# Altium schematic sheet BMS-6S-1B_Sch.SchDoc: BMS-6S-1B
size A4; Author: Zixi Chen; DocumentNumber: 1; Revision: 1; SheetNumber: 1; SheetTotal: 1
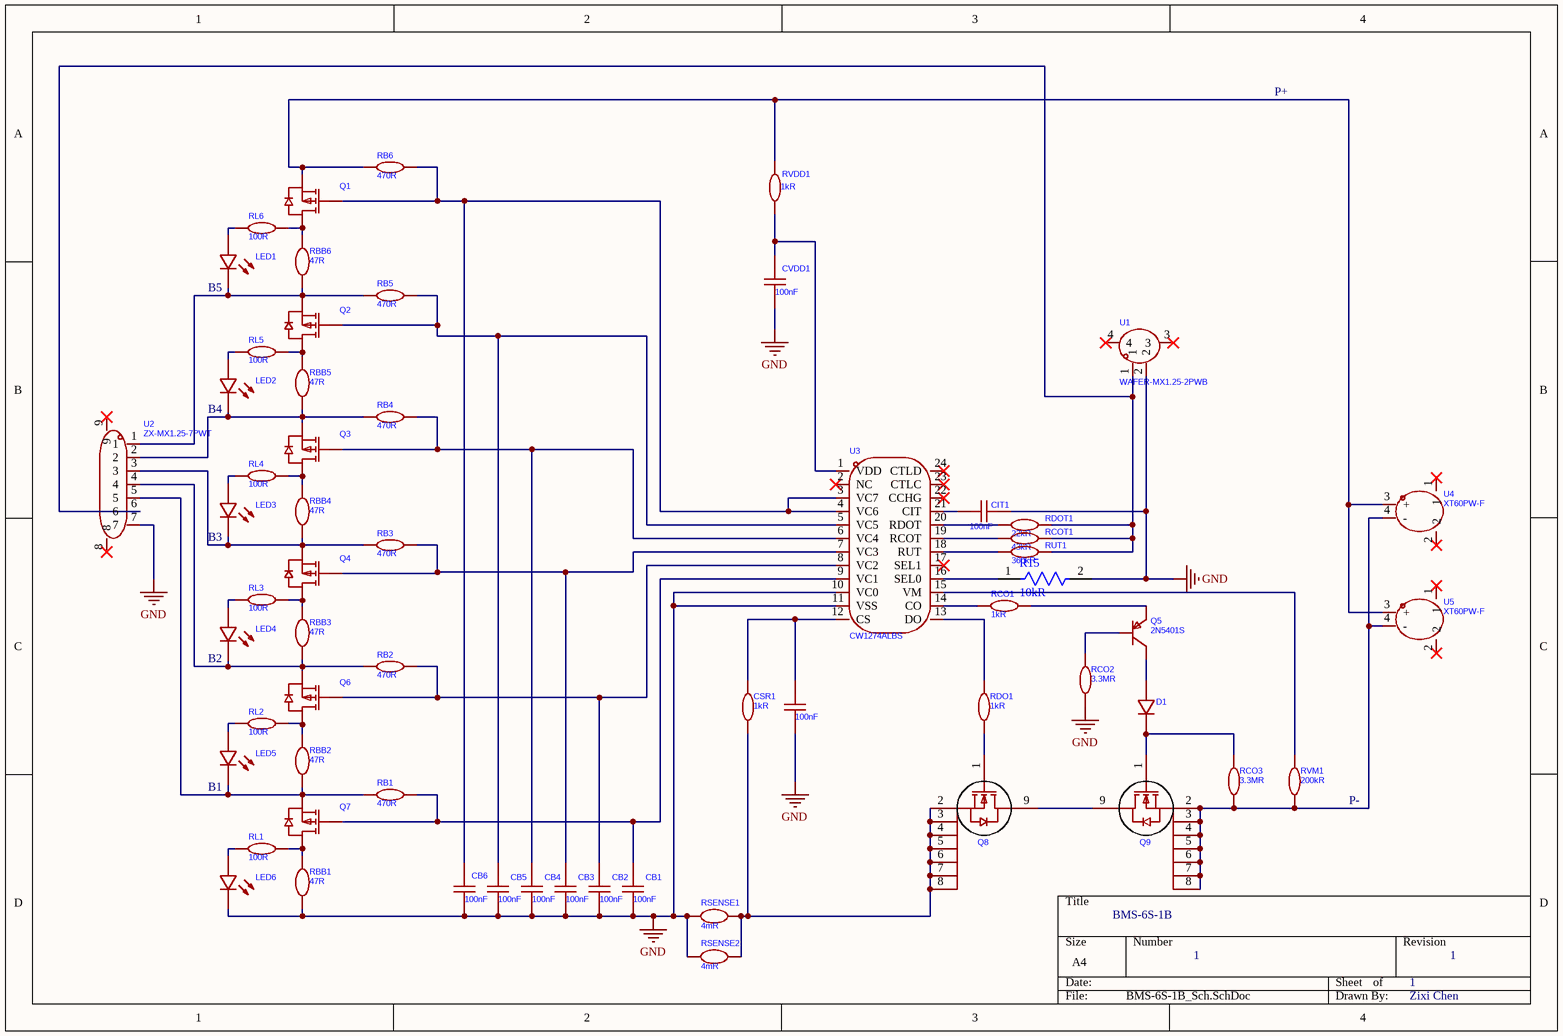
[diagram p0: BMS-6S-1B_Sch.SchDoc]

## Parts
CB1  100nF  [C0603]
CB2  100nF  [C0603]
CB3  100nF  [C0603]
CB4  100nF  [C0603]
CB5  100nF  [C0603]
CB6  100nF  [C0603]
CIT1  100nF  [C0603]
CSC1  100nF  [C0603]
CSR1  1kR  [R0603]
CVDD1  100nF  [C0603]
D1  1SS355_C8485  [SOD-323_L1.8-W1.3-LS2.5-RD]  (value not drawn)
LED1  NCD0603O1  [LED0603-RD]  (value not drawn)
LED2  NCD0603O1  [LED0603-RD]  (value not drawn)
LED3  NCD0603O1  [LED0603-RD]  (value not drawn)
LED4  NCD0603O1  [LED0603-RD]  (value not drawn)
LED5  NCD0603O1  [LED0603-RD]  (value not drawn)
LED6  NCD0603O1  [LED0603-RD]  (value not drawn)
Q1  AO3401A_C15127  [SOT-23_L2.9-W1.3-P1.90-LS2.4-BR]  (value not drawn)
Q2  AO3401A_C15127  [SOT-23_L2.9-W1.3-P1.90-LS2.4-BR]  (value not drawn)
Q3  AO3401A_C15127  [SOT-23_L2.9-W1.3-P1.90-LS2.4-BR]  (value not drawn)
Q4  AO3401A_C15127  [SOT-23_L2.9-W1.3-P1.90-LS2.4-BR]  (value not drawn)
Q5  2N5401S  [SOT-23-3_L2.9-W1.5-P2.0-LS2.5-BR]
Q6  AO3401A_C15127  [SOT-23_L2.9-W1.3-P1.90-LS2.4-BR]  (value not drawn)
Q7  AO3401A_C15127  [SOT-23_L2.9-W1.3-P1.90-LS2.4-BR]  (value not drawn)
Q8  IPLU250N04S4-1R7  [PG-HSOF-8_L10.5-W10.1-P1.20-LS11.9-TL]  (value not drawn)
Q9  IPLU250N04S4-1R7  [PG-HSOF-8_L10.5-W10.1-P1.20-LS11.9-TL]  (value not drawn)
R15  10kR  [FP-ESR10-IPC_C]
RB1  470R  [R0603]
RB2  470R  [R0603]
RB3  470R  [R0603]
RB4  470R  [R0603]
RB5  470R  [R0603]
RB6  470R  [R0603]
RBB1  47R  [R2512]
RBB2  47R  [R2512]
RBB3  47R  [R2512]
RBB4  47R  [R2512]
RBB5  47R  [R2512]
RBB6  47R  [R2512]
RCO1  1kR  [R0603]
RCO2  3.3MR  [R0603]
RCO3  3.3MR  [R0603]
RCOT1  43kR  [R0603]
RDO1  1kR  [R0603]
RDOT1  22kR  [R0603]
RL1  100R  [R0603]
RL2  100R  [R0603]
RL3  100R  [R0603]
RL4  100R  [R0603]
RL5  100R  [R0603]
RL6  100R  [R0603]
RSENSE1  4mR  [R3920]
RSENSE2  4mR  [R3920]
RUT1  360kR  [R0603]
RVDD1  1kR  [R0603]
RVM1  200kR  [R0603]
U1  WAFER-MX1.25-2PWB  [CONN-SMD_2P-P1.25_XUNPU_WAFER-MX1.25-2PWB]
U2  ZX-MX1.25-7PWT  [CONN-SMD_7P-P1.25_ZX-MX1.25-7PWT]
U3  CW1274ALBS  [SSOP-24_L8.7-W3.9-P0.64-LS6.0-BL]
U4  XT60PW-F  [TH_2P-XT60PW-F]
U5  XT60PW-F  [TH_2P-XT60PW-F]

## Nets
GND: CB1.1 CB2.1 CB3.1 CB4.1 CB5.1 CB6.1 CIT1.1 CSC1.1 CVDD1.1 LED6.1(K) R15.2 RBB1.1 RCO2.1 RSENSE1.1 RSENSE2.1 U1.2 U2.7 U3.10(VC0) U3.11(VSS)
NetCB1_2: CB1.2 Q7.1(G) RB1.2 U3.9(VC1)
NetCB2_2: CB2.2 Q6.1(G) RB2.2 U3.8(VC2)
NetCB3_2: CB3.2 Q4.1(G) RB3.2 U3.7(VC3)
NetCB4_2: CB4.2 Q3.1(G) RB4.2 U3.6(VC4)
NetCB5_2: CB5.2 Q2.1(G) RB5.2 U3.5(VC5)
NetCB6_2: CB6.2 Q1.1(G) RB6.2 U3.3(VC7) U3.4(VC6)
NetCIT1_2: CIT1.2 U3.21(CIT)
NetCSC1_2: CSC1.2 CSR1.2 U3.12(CS)
NetCSR1_1: CSR1.1 Q8.2(S) Q8.3(S) Q8.4(S) Q8.5(S) Q8.6(S) Q8.7(S) Q8.8(S) RSENSE1.2 RSENSE2.2
NetCVDD1_2: CVDD1.2 RVDD1.1 U3.1(VDD)
NetD1_1: D1.1(K) Q9.1(G) RCO3.2
NetD1_2: D1.2(A) Q5.3(C)
NetLED1_1: LED1.1(K) Q2.2(S) RB5.1 RBB6.1 U2.1
NetLED1_2: LED1.2(A) RL6.1
NetLED2_1: LED2.1(K) Q3.2(S) RB4.1 RBB5.1 U2.2
NetLED2_2: LED2.2(A) RL5.1
NetLED3_1: LED3.1(K) Q4.2(S) RB3.1 RBB4.1 U2.3
NetLED3_2: LED3.2(A) RL4.1
NetLED4_1: LED4.1(K) Q6.2(S) RB2.1 RBB3.1 U2.4
NetLED4_2: LED4.2(A) RL3.1
NetLED5_1: LED5.1(K) Q7.2(S) RB1.1 RBB2.1 U2.5
NetLED5_2: LED5.2(A) RL2.1
NetLED6_2: LED6.2(A) RL1.1
NetQ1_2: Q1.2(S) RB6.1 RVDD1.2 U4.3(+) U5.3(+)
NetQ1_3: Q1.3(D) RBB6.2 RL6.2
NetQ2_3: Q2.3(D) RBB5.2 RL5.2
NetQ3_3: Q3.3(D) RBB4.2 RL4.2
NetQ4_3: Q4.3(D) RBB3.2 RL3.2
NetQ5_1: Q5.1(B) RCO2.2
NetQ5_2: Q5.2(E) RCO1.2
NetQ6_3: Q6.3(D) RBB2.2 RL2.2
NetQ7_3: Q7.3(D) RBB1.2 RL1.2
NetQ8_1: Q8.1(G) RDO1.1
NetQ8_9: Q8.9(D) Q9.9(D)
NetQ9_2: Q9.2(S) Q9.3(S) Q9.4(S) Q9.5(S) Q9.6(S) Q9.7(S) Q9.8(S) RCO3.1 RVM1.1 U4.4(-) U5.4(-)
NetR15_1: R15.1 U3.16(SEL0)
NetRCO1_1: RCO1.1 U3.14(CO)
NetRCOT1_1: RCOT1.1 U3.19(RCOT)
NetRCOT1_2: RCOT1.2 RDOT1.2 RUT1.2 U1.1 U2.6
NetRDO1_2: RDO1.2 U3.13(DO)
NetRDOT1_1: RDOT1.1 U3.20(RDOT)
NetRUT1_1: RUT1.1 U3.18(RUT)
NetRVM1_2: RVM1.2 U3.15(VM)

Not connected (* = marked no-connect by the designer): U1 3* 4*; U2 8* 9*; U3 2(NC)* 17(SEL1)* 22(CCHG)* 23(CTLC)* 24(CTLD)*; U4 1* 2*; U5 1* 2*

## Notes on the sheet
- P+
- (near LED1) B5
- (near LED2) B4
- (near LED3) B3
- (near LED4) B2
- (near LED5) B1
- P-

## Library data of the parts
CB1-CB6 CIT1 CSC1 CVDD1 = CMP-003-000004-1: Manufacturer: muRata(村田); Convert to PCB: yes; Tolerance: 10%; Temperature Coefficient: X7R; Voltage Rating: 50V; Datasheet: https://item.szlcsc.com/datasheet/GCJ188R71H104KA12D/172496.html; Design Item ID: GCJ188R71H104KA12D; Supplier Part: C161115; Value: 100nF; LCSC Part Name: 100nF ±10% 50V; Source: ESM-111A.SchLib; Add into BOM: yes; Manufacturer Part: GCJ188R71H104KA12D; Device: GCJ188R71H104KA12D; Supplier Footprint: 0603; JLCPCB Part Class: Extended Part; Symbol: GCJ188R71H104KA12D
CSR1 RVDD1 = CMP-005-000004-1: Manufacturer: UNI-ROYAL(厚声); Voltage-Supply(Max): 75V; Power(Watts): 100mW; Symbol: 0603WAF1001T5E; Convert to PCB: yes; Tolerance: 1%; Value: 1k; Temperature Coefficient: ±100ppm/℃; Design Item ID: 0603WAF1001T5E; Add into BOM: yes; Supplier Part: C21190; Operating Temperature: -55℃~+155℃; LCSC Part Name: 1kΩ ±1% 100mW 厚膜电阻; Manufacturer Part: 0603WAF1001T5E; JLCPCB Part Class: Basic Part; Device: 0603WAF1001T5E; Supplier Footprint: 0603; Source: ESM-111A.SchLib; Type: Thick Film Resistor; Datasheet: https://item.szlcsc.com/datasheet/0603WAF1001T5E/21904.html
D1 = CMP-007-000001-1: Manufacturer: CJ(江苏长电/长晶); Manufacturer Part: 1SS355; Convert to PCB: yes; Reverse Recovery Time (trr): 4ns; Reverse Leakage Current (Ir): 100nA@80V; Voltage - Forward(Vf@If): 1.2V@100mA; Voltage - DC Reverse(Vr): 80V; Non-Repetitive Peak Forward Surge Current: 500mA; Current - Rectified: 100mA; Diode Configuration: Independent; Device: 1SS355_C8485; Design Item ID: 1SS355_C8485; LCSC Part Name: 1SS355; Datasheet: https://item.szlcsc.com/datasheet/1SS355/8979.html; Operating Junction Temperature Range: -; Supplier Part: C8485; Source: ESM-111A.SchLib; Supplier Footprint: SOD-323; JLCPCB Part Class: Extended Part; Add into BOM: yes; Symbol: 1SS355_C8485
LED1-LED6 = CMP-008-000000-1: Manufacturer: 国星光电; Add into BOM: yes; Emitted Color: Orange; Lens Color: 无色透明透镜; Dominant Wavelength: 600nm~610nm; Symbol: FC-D1608HOK-600H; Luminous Intensity: 80mcd~220mcd; Power Dissipation: 65mW; Viewing Angle: 130°; Forward Voltage (VF): 1.6V~2.6V; Forward Current: 20mA; JLCPCB Part Class: Extended Part; Datasheet: https://atta.szlcsc.com/upload/public/pdf/source/20200820/C84269_76D7AD616B091E5B61CAF71BD9DDF26F.pdf; Design Item ID: NCD0603O1; Convert to PCB: yes; Operating Temperature: -30℃~+85℃; Supplier Footprint: 0603; Supplier Part: C84269; Device: NCD0603O1; LCSC Part Name: NCD0603O1; Source: ESM-111A.SchLib; Manufacturer Part: NCD0603O1
Q1-Q4 Q6 Q7 = CMP-003-000001-1: Manufacturer: AOS; Drain to Source Voltage: 30V; Output Capacitance(Coss): 80pF; Current - Continuous Drain(Id): 4A; Reverse Transfer Capacitance (Crss@Vds): 55pF; Gate Charge(Qg): 14nC@10V; RDS(on): 47mΩ@10V；85mΩ@2.5V；60mΩ@4.5V; Gate Threshold Voltage (Vgs(th)): 900mV@250uA; Input Capacitance(Ciss): 645pF; Add into BOM: yes; Number: 1 P-Channel; Manufacturer Part: AO3401A; Supplier Footprint: SOT-23; Type: -; JLCPCB Part Class: Basic Part; Symbol: AO3401A; Datasheet: https://item.szlcsc.com/datasheet/AO3401A/15801.html; Supplier Part: C15127; Device: AO3401A_C15127; LCSC Part Name: 1个P沟道 耐压:30V 电流:4A; Source: ESM-111A.SchLib; Design Item ID: AO3401A_C15127; Operating Temperature: -; Pd - Power Dissipation: -; Convert to PCB: yes
Q5 = CMP-003-000000-1: Manufacturer: TECH PUBLIC(台舟); Transition frequency(fT): 300MHz; Convert to PCB: yes; DC Current Gain: 300@10mA,5V; Pd - Power Dissipation: 300mW; Current - Collector Cutoff: 50nA; Emitter-Base Voltage(Vebo): 6V; Current - Collector(Ic): 600mA; Collector - Emitter Voltage VCEO: 160V; Vce Saturation(VCE(sat)): 500mV@50mA,6mA; Manufacturer Part: 2N5401S; Datasheet: https://item.szlcsc.com/datasheet/2N5401S/8170936.html; Add into BOM: yes; Supplier Part: C7202978; Design Item ID: 2N5401S; Device: 2N5401S; Symbol: 2N5401S; Source: ESM-111A.SchLib; Supplier Footprint: SOT-23; LCSC Part Name: PNP开关晶体管; JLCPCB Part Class: Extended Part
Q8 Q9 = CMP-003-000003-1: Manufacturer: Infineon(英飞凌); Convert to PCB: yes; Reverse Transfer Capacitance (Crss@Vds): 105pF; Current - Continuous Drain(Id): 250A; Pd - Power Dissipation: 188W; Output Capacitance(Coss): 1.8nF; RDS(on): 1.7mΩ@10V; Drain to Source Voltage: 40V; Type: N-Channel; Gate Charge(Qg): 100nC@10V; Gate Threshold Voltage (Vgs(th)): 4V@80uA; Input Capacitance(Ciss): 7.9nF; Number: 1 N-Channel; Device: IPLU250N04S4-1R7; Manufacturer Part: IPLU250N04S4-1R7; Supplier Part: C537068; Add into BOM: yes; Supplier Footprint: HSOF-8; Design Item ID: IPLU250N04S4-1R7; Operating Temperature: -55℃~+175℃; Symbol: IPLU250N04S4-1R7; Source: ESM-111A.SchLib; LCSC Part Name: OptiMOS-T2功率晶体管; JLCPCB Part Class: Extended Part; Datasheet: https://item.szlcsc.com/datasheet/IPLU250N04S4-1R7/557481.html
R15 = CMP-08839-028179-1: 10kΩ ±0.5% 0.4W 0805 Anti-Surge Chip Resistor AEC-Q200; RoHS Compliant: Yes
RB1-RB6 = CMP-005-000010-1: Manufacturer: UNI-ROYAL(厚声); Symbol: 0603WAF4700T5E; Temperature Coefficient: ±100ppm/℃; Power(Watts): 100mW; Voltage-Supply(Max): 75V; Tolerance: 1%; Convert to PCB: yes; Value: 470; Type: Thick Film Resistor; LCSC Part Name: 470Ω ±1% 100mW 厚膜电阻; Supplier Part: C23179; Design Item ID: 0603WAF4700T5E; Manufacturer Part: 0603WAF4700T5E; Device: 0603WAF4700T5E; Supplier Footprint: 0603; Operating Temperature: -55℃~+155℃; Source: ESM-111A.SchLib; Datasheet: https://item.szlcsc.com/datasheet/0603WAF4700T5E/23906.html; Add into BOM: yes; JLCPCB Part Class: Basic Part
RBB1-RBB6 = CMP-005-000003-1: Manufacturer: FH(风华); Symbol: RC-12K47R0FT; Power(Watts): 1W; Add into BOM: yes; Tolerance: 1%; Voltage-Supply(Max): 200V; Temperature Coefficient: ±100ppm/℃; Value: 47; Design Item ID: RC-12K47R0FT; Datasheet: https://item.szlcsc.com/datasheet/RC-12K47R0FT/455959.html; JLCPCB Part Class: Extended Part; Supplier Part: C454019; Convert to PCB: yes; Source: ESM-111A.SchLib; Supplier Footprint: 2512; Type: Thick Film Resistor; Device: RC-12K47R0FT; LCSC Part Name: 厚膜电阻 47Ω ±1% 1W; Operating Temperature: -55℃~+155℃; Manufacturer Part: RC-12K47R0FT
RCO1 RDO1 = CMP-005-000015-1: Manufacturer Part: 0603WAF1001T5E; Manufacturer: UNI-ROYAL(厚声); Power(Watts): 100mW; Add into BOM: yes; Temperature Coefficient: ±100ppm/℃; Value: 1k; Tolerance: 1%; Voltage-Supply(Max): 75V; Datasheet: https://item.szlcsc.com/datasheet/0603WAF1001T5E/21904.html; LCSC Part Name: 1kΩ ±1% 100mW 厚膜电阻; Type: Thick Film Resistor; Operating Temperature: -55℃~+155℃; Supplier Part: C21190; Source: ESM-111A.SchLib; Supplier Footprint: 0603; Device: 0603WAF1001T5E; Convert to PCB: yes; JLCPCB Part Class: Basic Part; Symbol: 0603WAF1001T5E; Design Item ID: 0603WAF1001T5E
RCO2 RCO3 = CMP-005-000018-1: Manufacturer Part: 0603WAF3304T5E; Manufacturer: UNI-ROYAL(厚声); Value: 3.3M; Voltage-Supply(Max): 75V; Power(Watts): 100mW; Add into BOM: yes; Temperature Coefficient: ±100ppm/℃; Tolerance: 1%; JLCPCB Part Class: Extended Part; Source: ESM-111A.SchLib; Design Item ID: 0603WAF3304T5E; Device: 0603WAF3304T5E; LCSC Part Name: 3.3MΩ ±1% 100mW 厚膜电阻; Supplier Footprint: 0603; Operating Temperature: -55℃~+155℃; Supplier Part: C26096; Datasheet: https://item.szlcsc.com/datasheet/0603WAF3304T5E/26839.html; Convert to PCB: yes; Symbol: 0603WAF3304T5E; Type: Thick Film Resistor
RCOT1 = CMP-005-000009-1: Manufacturer: UNI-ROYAL(厚声); Power(Watts): 100mW; Convert to PCB: yes; Symbol: 0603WAF4302T5E; Value: 43k; Voltage-Supply(Max): 75V; Tolerance: 1%; Temperature Coefficient: ±100ppm/℃; Datasheet: https://item.szlcsc.com/datasheet/0603WAF4302T5E/23899.html; Type: Thick Film Resistor; LCSC Part Name: 43kΩ ±1% 100mW 厚膜电阻; Source: ESM-111A.SchLib; Supplier Footprint: 0603; Operating Temperature: -55℃~+155℃; Design Item ID: 0603WAF4302T5E; Device: 0603WAF4302T5E; Add into BOM: yes; JLCPCB Part Class: Extended Part; Supplier Part: C23172; Manufacturer Part: 0603WAF4302T5E
RDOT1 = CMP-005-000006-1: Manufacturer: UNI-ROYAL(厚声); Tolerance: 1%; Device: 0603WAF2202T5E; Power(Watts): 100mW; Convert to PCB: yes; Temperature Coefficient: ±100ppm/℃; Voltage-Supply(Max): 75V; Value: 22k; Type: Thick Film Resistor; Supplier Footprint: 0603; Datasheet: https://item.szlcsc.com/datasheet/0603WAF2202T5E/32812.html; Symbol: 0603WAF2202T5E; Source: ESM-111A.SchLib; Design Item ID: 0603WAF2202T5E; Supplier Part: C31850; Manufacturer Part: 0603WAF2202T5E; Add into BOM: yes; LCSC Part Name: 22kΩ ±1% 100mW 厚膜电阻; Operating Temperature: -55℃~+155℃; JLCPCB Part Class: Basic Part
RL1-RL6 = CMP-005-000012-1: Manufacturer: YAGEO(国巨); Tolerance: 1%; Temperature Coefficient: ±100ppm/℃; Add into BOM: yes; Value: 100; Source: ESM-111A.SchLib; JLCPCB Part Class: Extended Part; Datasheet: https://atta.szlcsc.com/upload/public/pdf/source/20180316/70C0E2BDAE7FCC62C531A5A58D202EE1.pdf; Design Item ID: RC0603FR-07100RL; Manufacturer Part: RC0603FR-07100RL; Device: RC0603FR-07100RL; Operating Temperature Range: -55℃~+155℃; Type: Thick Film Resistors; Supplier Footprint: 0603; Symbol: RC0603FR-07100RL; LCSC Part Name: 厚膜电阻 100Ω ±1% 100mW; Convert to PCB: yes; Supplier Part: C105588
RSENSE1 RSENSE2 = CMP-005-000013-1: Manufacturer Part: HolRS3920-3W-4mR-1%; Manufacturer: Milliohm(毫欧); Convert to PCB: yes; Value: 4m; Tolerance: 1%; Datasheet: https://atta.szlcsc.com/upload/public/pdf/source/20200522/C558625_7915B34B9186274EB7EA9862EBA9CEA8.pdf; LCSC Part Name: 4mΩ ±1% 3W; JLCPCB Part Class: Extended Part; Add into BOM: yes; Symbol: HOLRS3920-3W-4MR-1%; Design Item ID: HolRS3920-3W-4mR-1%; Device: HolRS3920-3W-4mR-1%; Supplier Part: C558632; Source: ESM-111A.SchLib; Supplier Footprint: 3920
RUT1 = CMP-005-000008-1: Manufacturer Part: 0603WAF3603T5E; Manufacturer: UNI-ROYAL(厚声); Add into BOM: yes; Power(Watts): 100mW; Tolerance: 1%; Voltage-Supply(Max): 75V; Value: 360k; Temperature Coefficient: ±100ppm/℃; Operating Temperature: -55℃~+155℃; Type: Thick Film Resistor; Datasheet: https://item.szlcsc.com/datasheet/0603WAF3603T5E/23873.html; JLCPCB Part Class: Extended Part; Supplier Footprint: 0603; Design Item ID: 0603WAF3603T5E; LCSC Part Name: 360kΩ ±1% 100mW 厚膜电阻; Device: 0603WAF3603T5E; Supplier Part: C23146; Symbol: 0603WAF3603T5E; Source: ESM-111A.SchLib; Convert to PCB: yes
RVM1 = CMP-005-000016-1: Manufacturer: UNI-ROYAL(厚声); Symbol: 0603WAF2003T5E; Temperature Coefficient: ±100ppm/℃; Value: 200k; Convert to PCB: yes; Tolerance: 1%; LCSC Part Name: 200kΩ ±1% 100mW 厚膜电阻; Supplier Part: C25811; Source: ESM-111A.SchLib; Operating Temperature Range: -55℃~+155℃; Design Item ID: 0603WAF2003T5E; Manufacturer Part: 0603WAF2003T5E; JLCPCB Part Class: Basic Part; Type: Thick Film Resistors; Datasheet: https://atta.szlcsc.com/upload/public/pdf/source/20200306/C422600_1E6D84923E4A46A82E41ADD87F860B5C.pdf; Device: 0603WAF2003T5E; Add into BOM: yes; Supplier Footprint: 0603
U1 = CMP-003-000017-1: Manufacturer: XUNPU(讯普); X-Length of Bottom Edge on Board (Spacing Line): 7.5mm; Current Rating: 1A; Number of PINs Per Row: 2; Reference Series: PicoBlade(MX 1.25); Add into BOM: yes; Plastic Material: LCP; Y-Width of Bottom Edge on Board: 5.25mm; Pins Structure: 1x2P; Z-Height of the Board: 3.6mm; Supplementary Features: Auxiliary Solder Pin; Voltage Rating: 125V; Pitch: 1.25mm; Symbol: WAFER-MX1.25-2PWB; Color: Beige; Flame Retardant Rating: -; Datasheet: https://item.szlcsc.com/datasheet/WAFER-MX1.25-2PWB/3561371.html; Contact Material: Brass; LCSC Part Name: 1x2P 间距:1.25mm 卧贴 系列:PicoBlade(MX 1.25); Contact Plating: Tin; JLCPCB Part Class: Extended Part; Source: ESM-111A.SchLib; Manufacturer Part: WAFER-MX1.25-2PWB; Row Spacing: -; Design Item ID: WAFER-MX1.25-2PWB; Convert to PCB: yes; Mounting Type: Surface Mount, Right Angle; Number of Pins: 2P; Supplier Part: C3029359; Supplier Footprint: SMD,P=1.25mm,卧贴; Device: WAFER-MX1.25-2PWB; Number of Rows: 1; Operating Temperature: -25℃~+85℃
U2 = CMP-003-000002-1: Manufacturer: Megastar(兆星); Y-Width of Bottom Edge on Board: 5.25mm; Z-Height of the Board: 3.6mm; Pitch: 1.25mm; Plastic Material: LCP; Convert to PCB: yes; Voltage Rating: 125V; Supplementary Features: Auxiliary Solder Pin; Number of PINs Per Row: 7; Reference Series: PicoBlade(MX 1.25); Pins Structure: 1x7P; Current Rating: 1A; X-Length of Bottom Edge on Board (Spacing Line): 13.75mm; Color: Beige; LCSC Part Name: 1x7P 间距:1.25mm 卧贴 系列:PicoBlade(MX 1.25); Operating Temperature: -25℃~+85℃; Device: ZX-MX1.25-7PWT; Source: ESM-111A.SchLib; Contact Material: Brass; Manufacturer Part: ZX-MX1.25-7PWT; Flame Retardant Rating: -; Row Spacing: -; Number of Rows: 1; JLCPCB Part Class: Extended Part; Datasheet: https://item.szlcsc.com/datasheet/ZX-MX1.25-7PWT/20550391.html; Number of Pins: 7P; Design Item ID: ZX-MX1.25-7PWT; Add into BOM: yes; Supplier Footprint: SMD,P=1.25mm,卧贴; Mounting Type: Surface Mount, Right Angle; Supplier Part: C19272380; Symbol: ZX-MX1.25-7PWT; Contact Plating: Tin
U3 = CMP-003-000022-1: Add into BOM: yes; Manufacturer Part: CW1274ALBS; Symbol: CW1274ALBS; Device: CW1274ALBS; Supplier Footprint: SSOP-24-150mil; JLCPCB Part Class: Extended Part; LCSC Part Name: CW1274ALBS; Supplier Part: C2688819; Source: ESM-111A.SchLib; Convert to PCB: yes; Datasheet: https://atta.szlcsc.com/upload/public/pdf/source/20210825/C2688819_42BA714DCD7637B3574D4658BF7F6BA0.pdf; Design Item ID: CW1274ALBS
U4 U5 = CMP-003-000021-1: Manufacturer: AMASS(艾迈斯); Symbol: XT60PW-F_C428722; InterfaceType: Female; Add into BOM: yes; NumberOfUSBHoles: -; InsulationMaterial: -; RatedCurrent: -; Type1: -; Source: ESM-111A.SchLib; Power: -; RecommendedWireGauge: -; Output: -; LCSC Part Name: AMASS(艾迈斯)插头连接器锂电池组充电接口 航模电调卧式焊板 母头 XT60PW-F; Interface: -; Datasheet: https://item.szlcsc.com/datasheet/XT60PW-F/423834.html; Size: -; Supplier Footprint: -; Design Item ID: XT60PW-F; Input: -; Device: XT60PW-F; Type: Horizontal plug; contact resistance: -; FlameRetardantGrade: -; JLCPCB Part Class: Extended Part; Belt length: -; Convert to PCB: yes; Colour: Yellow; Manufacturer Part: XT60PW-F; Supplier Part: C428722; specifications: -; RatedVoltage: -; MaximumCurrent: -; MetalMaterial: -